# EAGLE design CANBed2040_V1.1 (EAGLE 6.4)
DESCRIPTION: microOBD 200 OBD-II Module; HW_REV: 1.4; PCB_REV: C; PCB_SPEC1: Layer Count: 4; PCB_SPEC2: Size: 1.3" x 0.59"; PCB_SPEC3: Finish Thickness: 0.049" - 0.052"; PCB_SPEC4: Copper Weight: 1oz; TITLE: STM1120

## Sheet 1 of 2
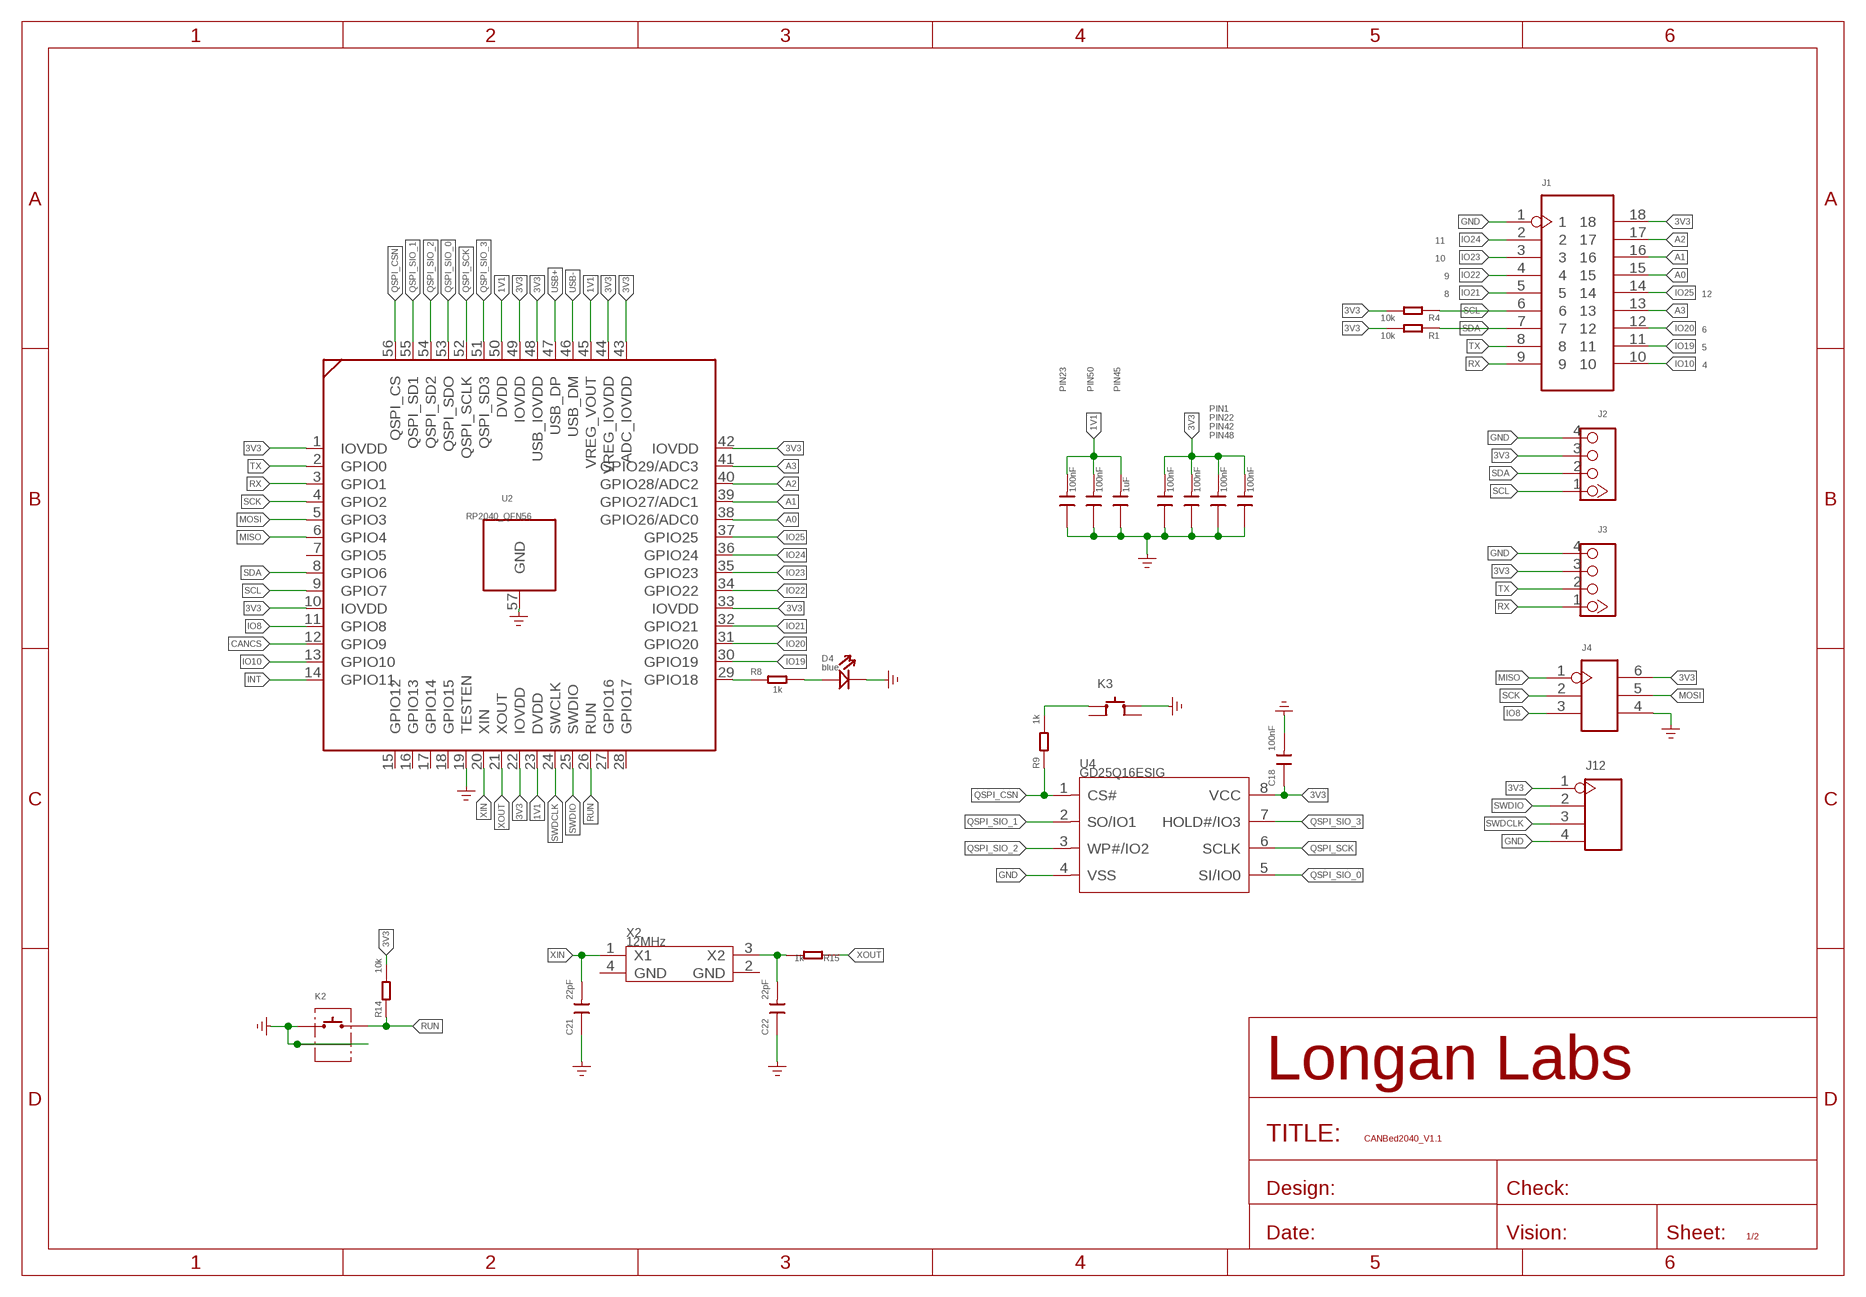
[diagram p0: schematic, sheet 1, part 1 of 2]
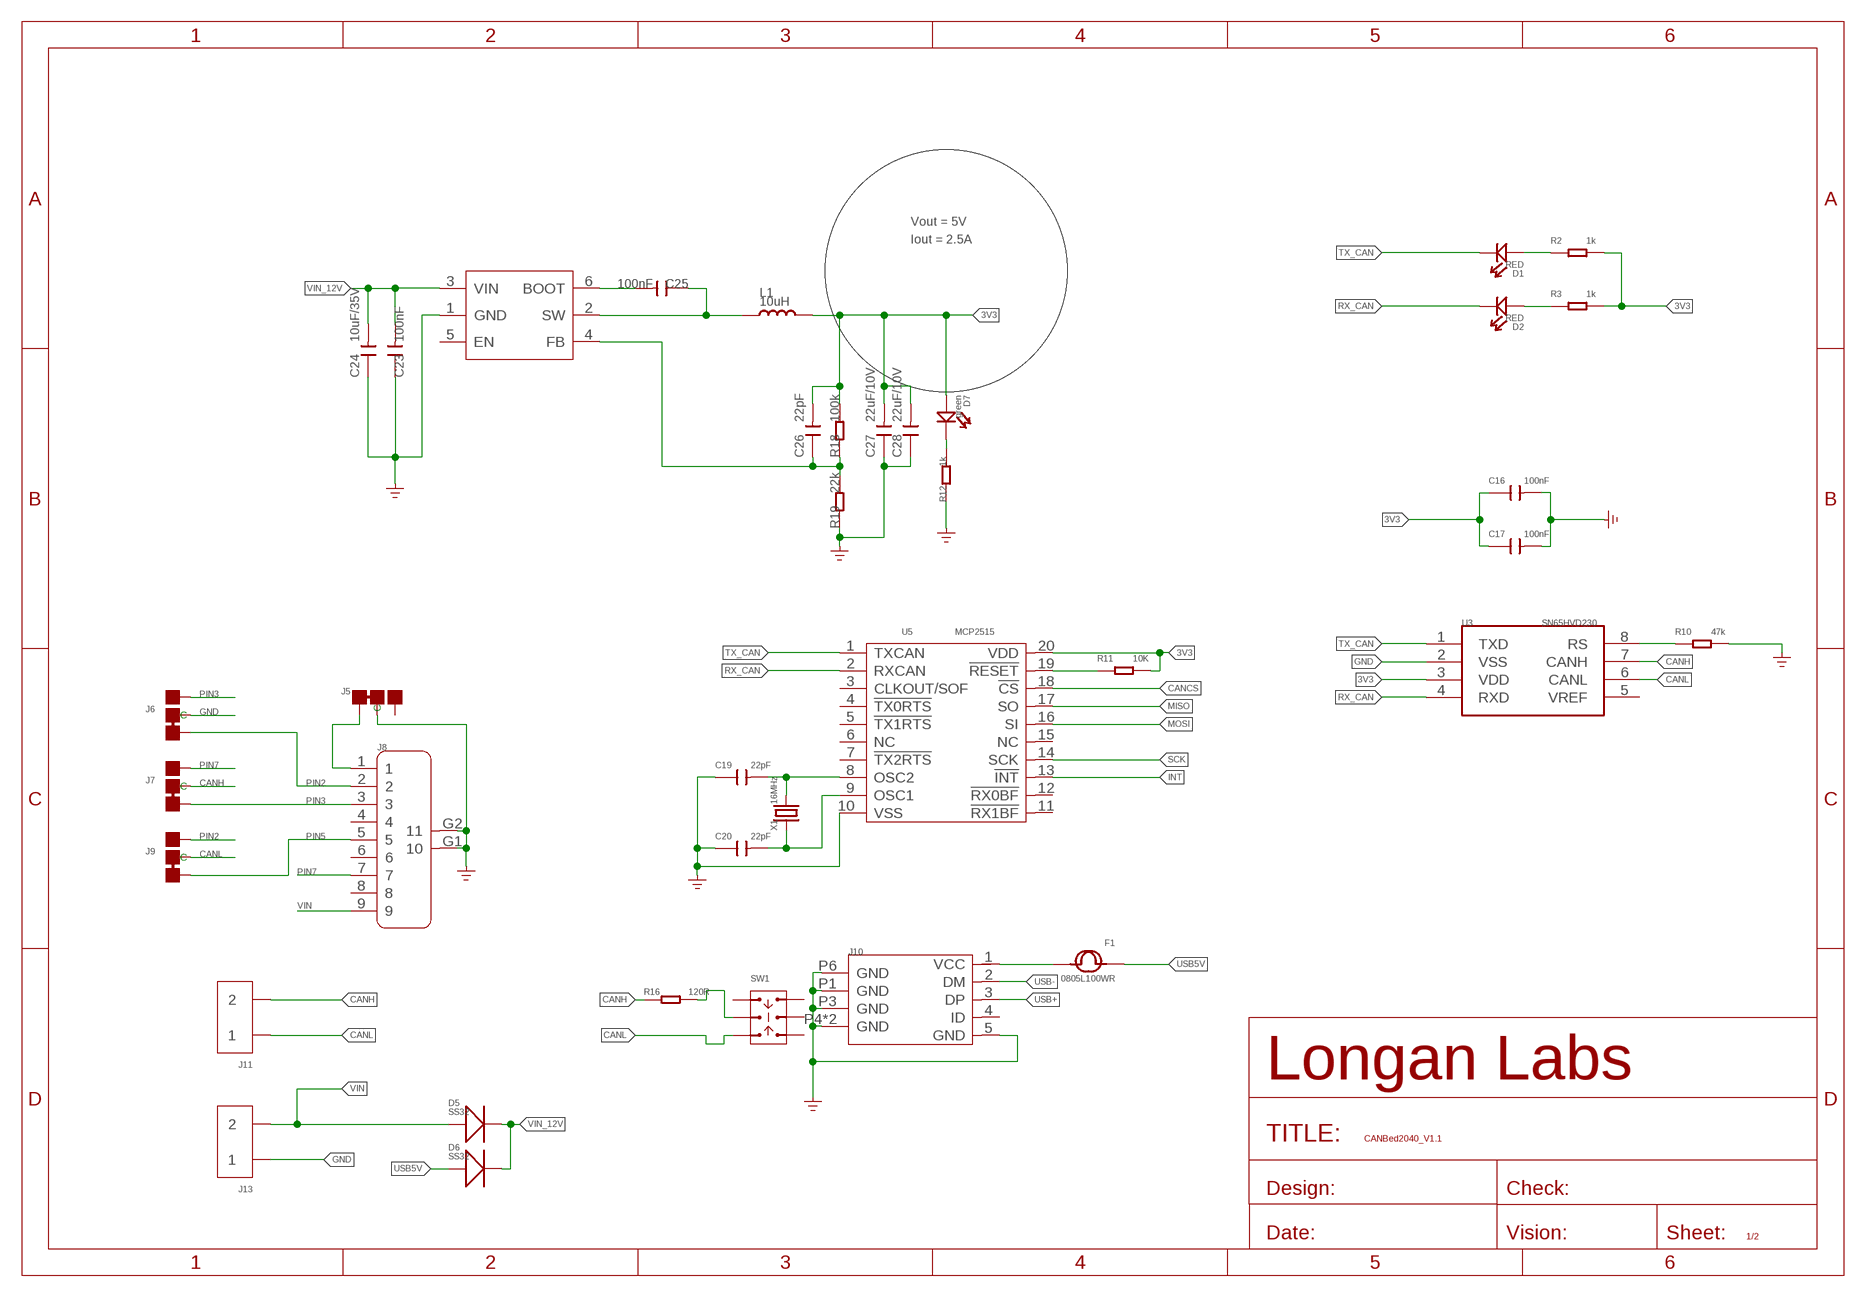
[diagram p1: schematic, sheet 1, part 2 of 2]

### Parts
C9  100nF  CAP-0603  [C0603]
C10  100nF  CAP-0603  [C0603]
C11  1uF  CAP-0603  [C0603]
C12  100nF  CAP-0603  [C0603]
C13  100nF  CAP-0603  [C0603]
C14  100nF  CAP-0603  [C0603]
C15  100nF  CAP-0603  [C0603]
C16  100nF  CAP-0603  [C0603]
C17  100nF  CAP-0603  [C0603]
C18  100nF  CAP-0603  [C0603]
C19  22pF  CAP-0603  [C0603]
C20  22pF  CAP-0603  [C0603]
C21  22pF  CAP-0603  [C0603]
C22  22pF  CAP-0603  [C0603]
C23  100nF  CAP-0603  [C0603]
C24  10uF/35V  CAP-1206  [C1206]
C25  100nF  CAP-0603  [C0603]
C26  22pF  CAP-0603  [C0603]
C27  22uF/10V  CAP-0805  [C0805]
C28  22uF/10V  CAP-0805  [C0805]
D1  RED  LED'0603'  [LED-0603]
D2  RED  LED'0603'  [LED-0603]
D4  blue  LED'0603'  [LED-0603]
D5  SS32  DIODE'SMA'  [DO-214AC]
D6  SS32  DIODE'SMA'  [DO-214AC]
D7  green  LED'0603'  [LED-0603]
F1  0805L100WR  FUSE0805  [F0805]
J1  HEADER-2X9P-2.54  [H2X9-2.54]
J2  320110033  GROVE-CONNECTOR-DIP-2.0  [HW4-2.0]
J3  320110033  GROVE-CONNECTOR-DIP-2.0  [HW4-2.0]
J4  HEADER-2X3P-2.54  [H2X3-2.54]
J5  JUMPER-3P-SHORT  [3P-SMD-SHORT]
J6  JUMPER-3P-SHORT  [3P-SMD-SHORT]
J7  JUMPER-3P-SHORT  [3P-SMD-SHORT]
J8  DB9'MEAL'  [DB9-MEAL]
J9  JUMPER-3P-SHORT  [3P-SMD-SHORT]
J10  MICRO-USB5+4P-320010050  [MICRO-USB5+5P-SMD-0.65-7.2X5.06MM]
J11  SCREW-TERMINAL-2P'5.08'  [H2-5.0-10.5X8.0MM]
J12  HEADER-4P-65/35MIL  [H4-2.54]
J13  SCREW-TERMINAL-2P'5.08'  [H2-5.0-10.5X8.0MM]
K2  BUTTON-2+2P  [SW2+2P-7.7X2.75X3.95MM]
K3  BUTTON-4P-4.5X4.5X3.3MM  [SW4-4.5X4.5X3.3MM]
L1  10uH  INDUCTOR-SPD3D16-4R7M  [L0420]
R1  10k  RES-0603  [R0603]
R2  1k  RES-0603  [R0603]
R3  1k  RES-0603  [R0603]
R4  10k  RES-0603  [R0603]
R8  1k  RES-0603  [R0603]
R9  1k  RES-0603  [R0603]
R10  47k  RES-0603  [R0603]
R11  10K  RES-0603  [R0603]
R12  1k  RES-0603  [R0603]
R14  10k  RES-0603  [R0603]
R15  1k  RES-0603  [R0603]
R16  120R  RES-0603  [R0603]
R18  100k  RES-0603  [R0603]
R19  22k  RES-0603  [R0603]
SW1  SWITCH-2CH-6P-311010004  [SW6-2.54-9.0X3.5X3.2+2.0MM]
U2  RP2040_QFN56  [RP2040_QFN56]
U3  SN65HVD230  MCP2551-SOIC8  [SOIC8-6.0]
U4  GD25Q16ESIG  FLASH-GD25Q16E  [SOP8-1.27-5.3X5.25X2MM]
U5  MCP2515  MCP2515'ST'  [TSSOP20-0.65-6.5X4.4MM]
U6  PMIC-TPS54302  [SOT-23-6]
X1  16MHz  CRYSTAL-2P-3225  [X4-SMD-3.2X2.5X0.7MM]
X2  12MHz  CRYSTAL-4P-3225  [X4-SMD-3.2X2.5X0.7MM]

### Nets
1V1: C9.2 C10.2 C11.2 U2.23(DVDD) U2.45(VREG_VOUT) U2.50(DVDD)
3V3: C12.2 C13.2 C14.2 C15.2 C16.1 C17.1 C18.1 C26.2 C27.2 C28.2 D7.+ J1.18 J2.3 J3.3 J4.6 J12.1 L1.2 R1.2 R2.2 R3.2 R4.2 R11.2 R14.2 R18.2 U2.1(IOVDD) U2.10(IOVDD) U2.22(IOVDD) U2.33(IOVDD) U2.42(IOVDD) U2.43(ADC_IOVDD) U2.44(VREG_IOVDD) U2.48(USB_IOVDD) U2.49(IOVDD) U3.3(VDD) U4.8(VCC) U5.20(VDD)
A0: J1.15 U2.38(GPIO26/ADC0)
A1: J1.16 U2.39(GPIO27/ADC1)
A2: J1.17 U2.40(GPIO28/ADC2)
A3: J1.13 U2.41(GPIO29/ADC3)
CANCS: U2.12(GPIO9) U5.18(!CS)
CANH: J7.MM(C) J11.2 R16.1 U3.7(CANH)
CANL: J9.MM(C) J11.1 SW1.CH1B U3.6(CANL)
EXT_PWR: F1.2 J10.1(VCC)
GND: C9.1 C10.1 C11.1 C12.1 C13.1 C14.1 C15.1 C16.2 C17.2 C18.2 C19.1 C20.1 C21.1 C22.1 C23.1 C24.1 C27.1 C28.1 D4.- J1.1 J2.4 J3.4 J4.4 J5.MM(C) J6.MM(C) J8.G1 J8.G2 J10.5(GND) J10.P1(GND) J10.P3(GND) J10.P4(GND) J10.P5(GND) J10.P6(GND) J12.4 J13.1 K2.1 K2.S1 K2.S2 K3.3(B0) R10.2 R12.1 R19.1 U2.19(TESTEN) U2.57(GND) U3.2(VSS) U4.4(VSS) U5.10(VSS) U6.1(GND) ; supply symbol labelled GND_POWER
INT: U2.14(GPIO11) U5.13(!INT)
IO8: J4.3 U2.11(GPIO8)
IO10: J1.10 U2.13(GPIO10)
IO19: J1.11 U2.30(GPIO19)
IO20: J1.12 U2.31(GPIO20)
IO21: J1.5 U2.32(GPIO21)
IO22: J1.4 U2.34(GPIO22)
IO23: J1.3 U2.35(GPIO23)
IO24: J1.2 U2.36(GPIO24)
IO25: J1.14 U2.37(GPIO25)
MISO: J4.1 U2.6(GPIO4) U5.17(SO)
MOSI: J4.5 U2.5(GPIO3) U5.16(SI)
N$2: D1.+ R2.1
N$3: R8.1 U2.29(GPIO18)
N$5: R16.2 SW1.COM1
N$6: D4.+ R8.2
N$7: K3.1(A0) R9.2
N$8: C22.2 R15.2 X2.3(X2)
N$11: D7.- R12.2
N$12: C25.1 L1.1 U6.2(SW)
N$13: J5.11(L) J8.1
N$14: C25.2 U6.6(BOOT)
N$15: D2.+ R3.1
N$16: C19.2 U5.8(OSC2) X1.3
N$17: C20.2 U5.9(OSC1) X1.1
N$20: R10.1 U3.8(RS)
N$26: C26.1 R18.1 R19.2 U6.4(FB)
PIN2: J6.11(L) J8.2 J9.00(R)
PIN3: J6.00(R) J7.11(L) J8.3
PIN5: J8.5 J9.11(L)
PIN7: J7.00(R) J8.7
QSPI_CSN: R9.1 U2.56(QSPI_CS) U4.1(CS#)
QSPI_SCK: U2.52(QSPI_SCLK) U4.6(SCLK)
QSPI_SIO_0: U2.53(QSPI_SDO) U4.5(SI/IO0)
QSPI_SIO_1: U2.55(QSPI_SD1) U4.2(SO/IO1)
QSPI_SIO_2: U2.54(QSPI_SD2) U4.3(WP#/IO2)
QSPI_SIO_3: U2.51(QSPI_SD3) U4.7(HOLD#/IO3)
RST_N: R11.1 U5.19(!RESET)
RUN: K2.2 R14.1 U2.26(RUN)
RX: J1.9 J3.1 U2.3(GPIO1)
RX_CAN: D2.- U3.4(RXD) U5.2(RXCAN)
SCK: J4.2 U2.4(GPIO2) U5.14(SCK)
SCL: J1.6 J2.1 R4.1 U2.9(GPIO7)
SDA: J1.7 J2.2 R1.1 U2.8(GPIO6)
SWDCLK: J12.3 U2.24(SWCLK)
SWDIO: J12.2 U2.25(SWDIO)
TX: J1.8 J3.2 U2.2(GPIO0)
TX_CAN: D1.- U3.1(TXD) U5.1(TXCAN)
USB5V: D6.1(+) F1.1
USB+: J10.3(DP) U2.47(USB_DP)
USB-: J10.2(DM) U2.46(USB_DM)
VIN: D5.1(+) J8.9 J13.2
VIN_12V: C23.2 C24.2 D5.2(-) D6.2(-) U6.3(VIN)
XIN: C21.2 U2.20(XIN) X2.1(X1)
XOUT: R15.1 U2.21(XOUT)
Unconnected: J5.00(R) J8.4 J8.6 J8.8 J10.4(ID) K3.2(A1) K3.4(B1) SW1.CH1A SW1.CH2A SW1.CH2B SW1.COM2 U2.7(GPIO5) U2.15(GPIO12) U2.16(GPIO13) U2.17(GPIO14) U2.18(GPIO15) U2.27(GPIO16) U2.28(GPIO17) U3.5(VREF) U5.3(CLKOUT/SOF) U5.4(!TX0RTS) U5.5(!TX1RTS) U5.6(NC) U5.7(!TX2RTS) U5.11(!RX1BF) U5.12(!RX0BF) U5.15(NC) U6.5(EN) X2.2(GND) X2.4(GND)

### Notes on the sheet
- Vout = 5V
- 11 | Iout = 2.5A
- 10
- 9
- 8 | 12
- 6
- 5
- 4
- PIN23 | PIN50 | PIN45
- PIN1
- PIN22
- PIN42
- PIN48

## Sheet 2 of 2

## Library data of the parts
C9-C28 = Discrete-new:CAP: Ceramic Capacitors
D1 D2 D4 D7 = Discrete-new:LED
D5 D6 = Discrete-new:DIODE*
F1 = Discrete-small:FUSE
J1 = Connector-new:HEADER-2X9P
J2 J3 = Connector-new:GROVE-CONNECTOR-DIP: 4P-2.0:320110033;4P-2.0-90D:320110034
J4 = Connector-new:HEADER-2X3P
J5-J7 J9 = Discrete-new:JUMPER-3P-SHORT
J8 = Connector:DB9
J10 = Connector-new:MICRO-USB5+4P: 320010137:MICRO USB B型DIP 沉板0.7无卷边 -ST-USB-01H2 320010000:MICRO USB 5F CCHT 6.45(0.8X0.9) -ST-USB-001G 320010050:USB-MC-001-05 320010025:MICRO USB 5S AB TYPE DIP7.2
J11 J13 = Connector-new:SCREW-TERMINAL-2P: 2P-3.5:320110028;2P-5.0:320110031
J12 = Connector-new:HEADER-4P
K2 = Connector-new:BUTTON-2+2P
K3 = Switch:BUTTON-4P
L1 = Discrete-new:INDUCTOR
R1-R4 R8-R12 R14-R16 R18 R19 = Discrete-new:RES
SW1 = Switch:SWITCH-2CH-6P
U2 = RP2040_QFN56:RP2040_QFN56
U3 = IC:MCP2551: High-Speed CAN Transceiver http://ww1.microchip.com/downloads/en/devicedoc/21667f.pdf
U4 = Longan-IC:FLASH-GD25Q16E
U5 = Heilight:MCP2515
U6 = IC-new:PMIC-TPS54302
X1 = Discrete-new:CRYSTAL-2P
X2 = Discrete-new:CRYSTAL-4P

## Net classes
3 usbvcc: width 0.152 mm, drill 0.152 mm, clearance 0.152 mm

## Board
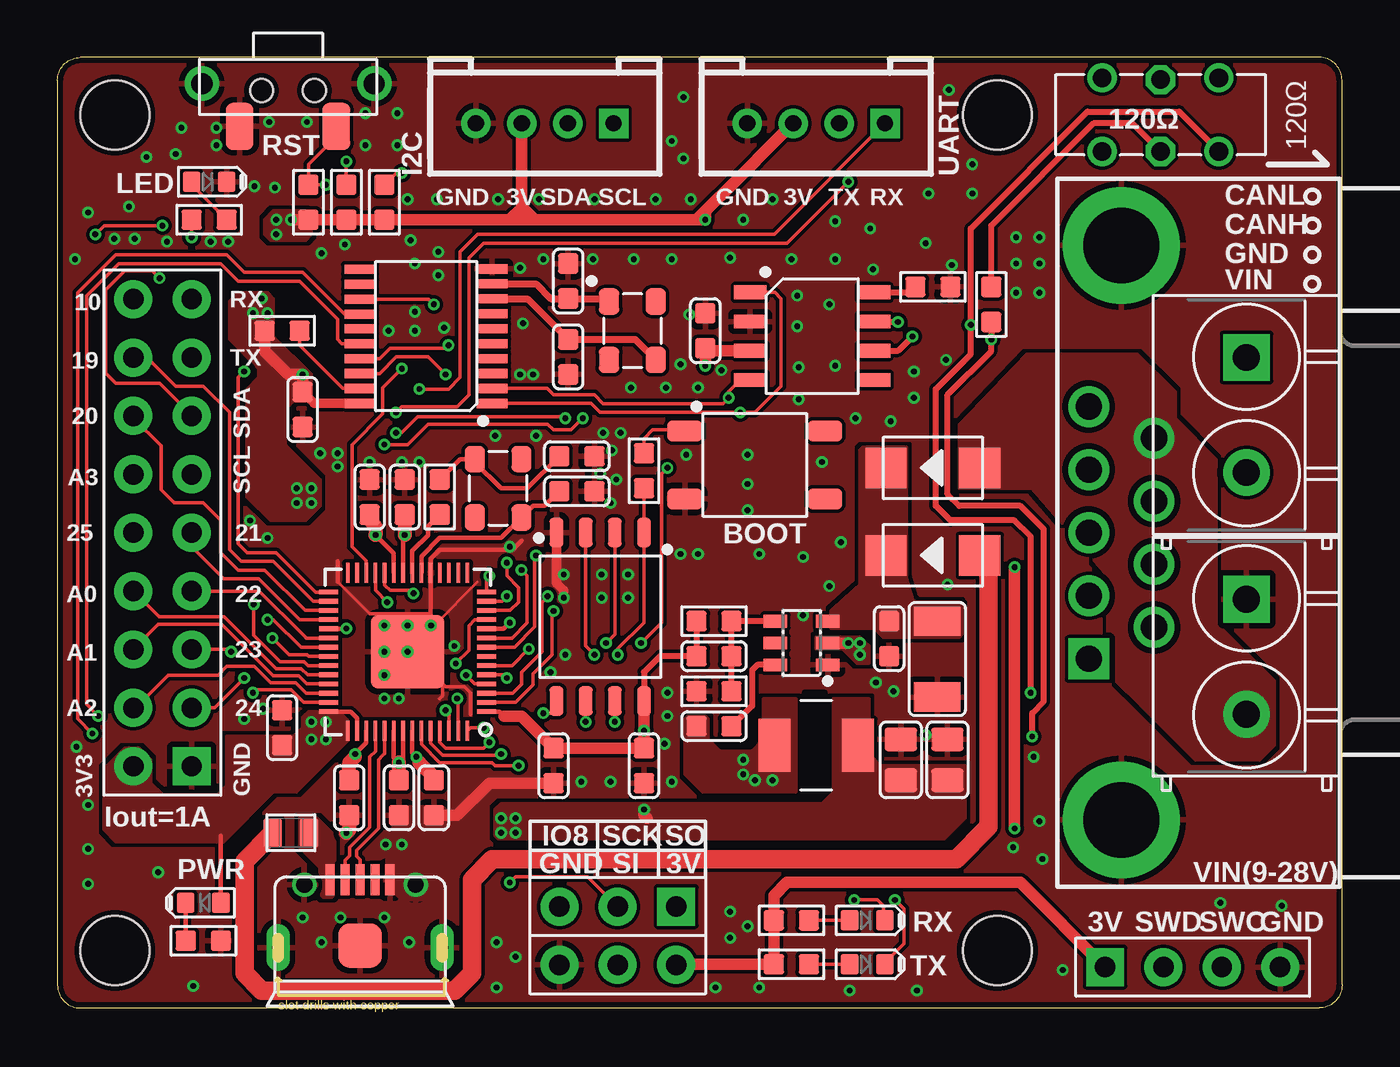
[diagram p2: board, top side]
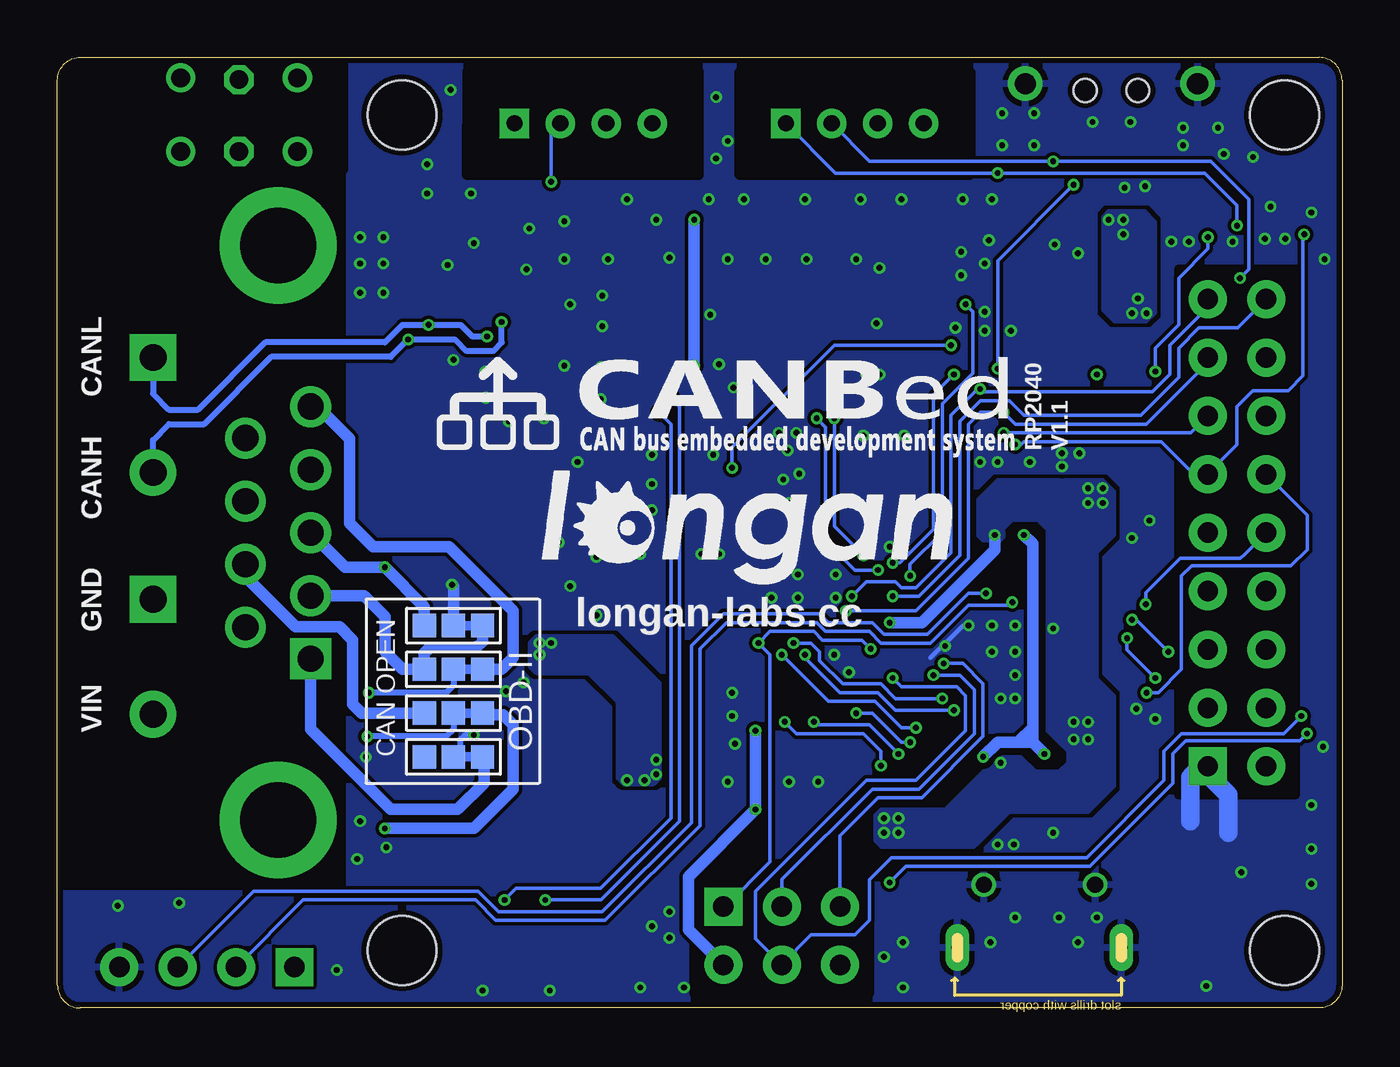
[diagram p3: board, bottom side, seen from below]

Size 55.91 x 41.35 mm. Coordinates in mm from the lower left corner, seen from the top.
Outline: 1,0 54.91,0 arc90 55.91,1 55.91,40.35 arc84 55.01,41.35 1,41.35 arc90 0,40.35 0,1 arc90 1,0
Copper layers (1*16): Top 0.035mm / dielectric 1.5mm / Bottom 0.035mm
Design rules "SeeedStudio_2layer_DRU_no_angle_20140221": minimum track width 1mil, minimum drill 10mil, track to track 6mil, track to pad 6mil, pad to pad 6mil, via to via 6mil, smd to smd 0mil, copper to edge 10mil, drill to drill 10mil, minimum pad ring 4mil, minimum via ring 4mil, stop-mask expansion 2mil, vias tented up to drill 25mil, thermal gap 10mil
Holes 3 mm at 2.5,38.85 2.5,2.5 40.91,38.85 40.91,2.5
tRestrict: area 32.5,9.5 to 33.4,13.7
bRestrict: area 16.2,36.3 to 26.2,40.7; area 28,36.2 to 38.1,40.7; area 2,9.3 to 7.1,32.1; area 43.6,5.3 to 55.8,36.1; area 20.6,0.6 to 28.2,5.7; area 43.4,36.5 to 52.6,41.3

### Footprints (pad centres in the part's own frame; a part is rotated, then mirrored left to right if it is on the bottom)
C0603 = smd 0.889 x 0.889: 1 -0.762,0; 2 0.762,0
C1206 = smd 1.27 x 2.032: 1 -1.651,0; 2 1.651,0
C0805 = smd 1.016 x 1.397: 1 -0.889,0; 2 0.889,0
LED-0603 = smd 0.762 x 0.889: + 0.762,0; - -0.762,0
DO-214AC = smd 1.8 x 1.77: 1 -2.042,0; 2 2.042,0
F0805 = smd 0.819 x 1.27: 1 -0.79,0; 2 0.79,0
H2X9-2.54 = drill 0.889 pad 1.651 square: 1 -1.27,10.16 | drill 0.889 pad 1.651: 2 -1.27,7.62; 3 -1.27,5.08; 4 -1.27,2.54; 5 -1.27,0; 6 -1.27,-2.54; 7 -1.27,-5.08; 8 -1.27,-7.62; 9 -1.27,-10.16; 10 1.27,-10.16; 11 1.27,-7.62; 12 1.27,-5.08; 13 1.27,-2.54; 14 1.27,0; 15 1.27,2.54; 16 1.27,5.08; 17 1.27,7.62; 18 1.27,10.16
HW4-2.0 = drill 0.7 pad 1.27 square: 1 -3,0 | drill 0.7 pad 1.27: 2 -1,0; 3 1,0; 4 3,0
H2X3-2.54 = drill 0.889 pad 1.651 square: 1 -1.27,2.54 | drill 0.889 pad 1.651: 2 -1.27,0; 3 -1.27,-2.54; 4 1.27,-2.54; 5 1.27,0; 6 1.27,2.54
3P-SMD-SHORT = smd 1.016 x 1.016: 00 -1.27,0; 11 1.27,0; MM 0,0
DB9-MEAL = drill 1.143 pad 1.778 square: 1 -5.486,1.422 | drill 1.143 pad 1.778: 2 -2.743,1.422; 3 0,1.422; 4 2.743,1.422; 5 5.486,1.422; 6 -4.115,-1.422; 7 -1.372,-1.422; 8 1.372,-1.422; 9 4.115,-1.422 | drill 3.302 pad 5.08: G1 12.497,0; G2 -12.497,0
MICRO-USB5+5P-SMD-0.65-7.2X5.06MM = smd 0.4 x 1.35: 1 -1.3,2.875; 2 -0.65,2.875; 3 0,2.875; 4 0.65,2.875; 5 1.3,2.875 | smd 1.9 x 1.9: P1 0,0 | drill 0.508 pad 1.016 long: P3 -3.575,-0.08; P4 3.575,-0.08 | drill 0.7: P5 -2.425,2.65; P6 2.425,2.65
H2-5.0-10.5X8.0MM = drill 1.168 pad 2.032 square: 1 0,2.5 | drill 1.168 pad 2.032: 2 0,-2.5
H4-2.54 = drill 0.889 pad 1.651 square: 1 0,3.81 | drill 0.889 pad 1.651: 2 0,1.27; 3 0,-1.27; 4 0,-3.81
SW2+2P-7.7X2.75X3.95MM = smd 1.2 x 2.032: 1 -2.1,-0.254; 2 2.1,-0.254 | drill 0.924 pad 1.5: S1 -3.75,1.6; S2 3.75,1.6 | hole 1: -1.15,1.3; 1.15,1.3
SW4-4.5X4.5X3.3MM = smd 1.5 x 0.9: 1 -3.05,1.475; 2 3.05,1.475; 3 -3.05,-1.475; 4 3.05,-1.475
L0420 = smd 1.4 x 2.3: 1 -1.815,0; 2 1.815,0
R0603 = smd 0.889 x 0.889: 1 -0.762,0; 2 0.762,0
SW6-2.54-9.0X3.5X3.2+2.0MM = drill 0.813 pad 1.27: CH1A -2.54,-1.6; CH1B 2.54,-1.6; CH2A -2.54,1.6; CH2B 2.54,1.6 | drill 0.813 pad 1.27 octagon: COM1 0,-1.6; COM2 0,1.524
RP2040_QFN56 = smd 0.875 x 0.2: 1 -3.438,2.6; 2 -3.438,2.2; 3 -3.438,1.8; 4 -3.438,1.4; 5 -3.438,1; 6 -3.438,0.6; 7 -3.438,0.2; 8 -3.438,-0.2; 9 -3.438,-0.6; 10 -3.438,-1; 11 -3.438,-1.4; 12 -3.438,-1.8; 13 -3.438,-2.2; 14 -3.438,-2.6; 29 3.438,-2.6; 30 3.438,-2.2; 31 3.438,-1.8; 32 3.438,-1.4; 33 3.438,-1; 34 3.438,-0.6; 35 3.438,-0.2; 36 3.438,0.2; 37 3.438,0.6; 38 3.438,1; 39 3.438,1.4; 40 3.438,1.8; 41 3.438,2.2; 42 3.438,2.6 | smd 0.2 x 0.875: 15 -2.6,-3.438; 16 -2.2,-3.438; 17 -1.8,-3.438; 18 -1.4,-3.438; 19 -1,-3.438; 20 -0.6,-3.438; 21 -0.2,-3.438; 22 0.2,-3.438; 23 0.6,-3.438; 24 1,-3.438; 25 1.4,-3.438; 26 1.8,-3.438; 27 2.2,-3.438; 28 2.6,-3.438; 43 2.6,3.438; 44 2.2,3.438; 45 1.8,3.438; 46 1.4,3.438; 47 1,3.438; 48 0.6,3.438; 49 0.2,3.438; 50 -0.2,3.438; 51 -0.6,3.438; 52 -1,3.438; 53 -1.4,3.438; 54 -1.8,3.438; 55 -2.2,3.438; 56 -2.6,3.438 | smd 3.2 x 3.2: 57 0,0
SOIC8-6.0 = smd 0.6 x 1.4: 1 -1.905,-2.7; 2 -0.635,-2.7; 3 0.635,-2.7; 4 1.905,-2.7; 5 1.905,2.7; 6 0.635,2.7; 7 -0.635,2.7; 8 -1.905,2.7
SOP8-1.27-5.3X5.25X2MM = smd 0.6 x 1.27: 1 -1.905,-3.665; 2 -0.635,-3.665; 3 0.635,-3.665; 4 1.905,-3.665; 5 1.905,3.665; 6 0.635,3.665; 7 -0.635,3.665; 8 -1.905,3.665
TSSOP20-0.65-6.5X4.4MM = smd 0.4 x 1.35: 1 -2.925,-2.875; 2 -2.275,-2.875; 3 -1.625,-2.875; 4 -0.975,-2.875; 5 -0.325,-2.875; 6 0.325,-2.875; 7 0.975,-2.875; 8 1.625,-2.875; 9 2.275,-2.875; 10 2.925,-2.875; 11 2.91,2.875; 12 2.26,2.875; 13 1.61,2.875; 14 0.96,2.875; 15 0.325,2.875; 16 -0.325,2.875; 17 -0.975,2.875; 18 -1.625,2.875; 19 -2.275,2.875; 20 -2.925,2.875
SOT-23-6 = smd 0.55 x 1.016: 1 -0.95,-1.143; 2 0,-1.143; 3 0.95,-1.143; 4 0.95,1.143; 5 0,1.143; 6 -0.95,1.143
X4-SMD-3.2X2.5X0.7MM = smd 1.143 x 0.889: 1 -1.27,-1.016; 2 1.27,-1.016; 3 1.27,1.016; 4 -1.27,1.016

### Placement (x,y rotation side)
C9  13.59,22.23 270 top
C10  16.38,9.14 90 top
C11  12.7,9.14 90 top
C12  21.59,10.54 90 top
C13  15.11,22.23 270 top
C14  9.78,12.19 270 top
C15  14.86,9.14 90 top
C16  10.67,26.04 270 top
C17  28.19,29.46 90 top
C18  25.53,10.54 270 top
C19  22.22,28.32 90 top
C20  22.22,31.62 270 top
C21  22.61,22.48 180 top
C22  22.61,24 180 top
C23  36.19,16.07 90 top
C24  38.29,15.18 90 top
C25  28.57,12.26 0 top
C26  28.57,15.3 180 top
C27  36.7,10.8 270 top
C28  38.73,10.8 270 top
D1  35.24,1.91 180 top
D2  35.24,3.81 180 top
D4  6.6,35.94 180 top
D5  38.1,23.5 180 top
D6  38.1,19.68 180 top
D7  6.35,4.57 0 top
F1  10.16,7.62 0 top
J1  4.57,20.68 180 top
J2  21.21,38.48 180 top
J3  33.02,38.48 180 top
J4  24.38,3.14 270 top
J5  38.67,10.92 0 bottom
J6  38.67,16.64 0 bottom
J7  38.67,12.83 0 bottom
J8  46.31,20.68 90 top
J9  38.67,14.73 0 bottom
J10  13.17,2.71 0 top
J11  51.75,25.8 0 top
J12  49.4,1.78 90 top
J13  51.75,15.28 0 top
K2  10.03,38.61 0 top
K3  30.35,23.62 0 top
L1  33.02,11.43 0 top
R1  12.57,35.05 270 top
R2  31.94,1.91 180 top
R3  31.94,3.81 180 top
R4  14.22,35.05 270 top
R8  6.6,34.29 0 top
R9  25.53,23.37 90 top
R10  38.1,31.37 0 top
R11  9.78,29.46 180 top
R12  6.35,2.92 180 top
R14  10.92,35.05 270 top
R15  16.64,22.23 90 top
R16  40.64,30.61 90 top
R18  28.57,16.83 180 top
R19  28.57,13.78 0 top
SW1  48.01,38.86 0 top
U2  15.24,15.49 180 top
U3  32.85,29.23 270 top
U4  23.62,17.02 180 top
U5  16.05,29.22 90 top
U6  32.38,15.88 90 top
U$12  [LONGAN-SILK-SMALL]  36.44,16.97 0 bottom
X1  25.02,29.46 270 top
X2  19.18,22.61 90 top

### Tracks (layer width: path | path; a pad name or v marks a point on that pad's centre or on a via)
1V1  (via drill 0.25 pad 0.51)
  Top 0.203: U2.23 14.64,19.78 v13.84,20.57 | U2.45 13.44,11.53 v12.95,11.05 12.95,10.92 | U2.50 15.44,11.1 v15.62,10.92 15.62,10.8 15.75,10.67
  Top 0.61: C9.2 13.59,21.21 13.84,20.95 v13.84,20.57 | C10.2 16.38,10.03 15.75,10.67 | C11.2 12.7,10.67 12.95,10.92
  Bottom 0.508: v12.95,11.05 13.46,11.56 | 13.46,11.56 14.1,11.56 | 14.1,11.56 14.99,11.56 v15.62,10.92 | 13.46,11.56 13.46,12.19 | v13.84,20.57 13.46,20.19 13.46,12.57 13.46,12.19 | 13.46,12.19 14.1,11.56
3V3  (via drill 0.25 pad 0.51)
  Top 0.203: U2.33 12.56,16.49 v12.57,16.51 | U2.22 15.04,20.5 v15.11,20.57 | U2.44 13.04,12.61 12.76,12.89 U2.42 | U2.48 14.64,10.89 v14.86,10.67 15.04,10.85 U2.49 | U2.1 19.24,12.89 19.43,12.7 | U2.10 19.41,16.49 v19.68,16.76 | D7.+ 7.11,7.49
  Top 0.254: R18.2 C26.2 26.23,15.3 25.53,14.6 U4.8
  Top 0.406: C16.1 11.16,26.3 U5.20 | C12.2 21.84,11.3
  Top 0.508: J2.3 20.21,34.31 20.19,34.29 | J4.6 26.96,1.91 R2.2 R3.2 31.18,4.89 31.75,5.46 41.91,5.46 J12.1 | J3.3 28.84,35.31 28.83,35.31 28.19,34.67 | C16.1 v10.67,27.56 10.03,27.56 9.02,28.57 R11.2 | v10.16,34.29 R14.2 R1.2 R4.2 19.68,34.29 | 19.43,12.7 20.19,12.7 C12.2 C18.1 v25.53,12.06 U4.8 | U3.3 28.3,28.59 C17.1 v28.19,27.94 | 19.68,34.29 20.19,34.29 | 20.19,34.29 20.76,34.29 | 20.76,34.29 27.81,34.29 | 27.81,34.29 v28.19,34.29 28.19,34.67 | 19.68,34.29 20.19,34.8 20.26,34.8 20.76,34.29 | 27.81,34.29 28.19,34.67 | v25.53,8.64 25.53,8.38 25.65,8.26
  Top 0.61: C13.2 v15.11,20.57 | C15.2 v14.86,10.67
  Bottom 0.508: J4.6 28.45,3.4 28.45,5.72 v25.53,8.64 v25.53,12.06 | v15.11,20.57 15.11,19.94 18.29,16.76 v19.68,16.76 | v28.19,27.94 v28.19,34.29
  other vias: 11.05,12.45 11.05,11.68 11.68,11.68 11.68,12.45 19.3,8.26 19.94,8.26 19.94,7.62 19.3,7.62 11.05,22.61 10.41,22.61 10.41,21.97 11.05,21.97 9.14,30.23 8.51,30.23 8.89,30.86 9.52,34.29 9.52,33.66
  pour Top (isolate 0.254, no thermals): 9.4,9.4 7.24,7.24 2.54,7.24 2.03,7.75 2.03,10.41 2.92,11.3 3.56,11.3 4.06,10.8 4.06,9.78 4.57,9.27 6.96,9.27 7.37,9.67 7.37,11.81 10.29,11.81 10.67,12.19 10.67,12.64 10.92,12.89 12.26,12.89 12.64,12.51 12.64,11.62 10.41,9.4 10.14,9.4
  pour Bottom (isolate 0.254, no thermals): 14.35,21.21 13.23,21.21 12.83,20.81 12.83,12.06 11.94,11.18 11.94,10.67 12.32,10.29 13.33,10.29 13.97,10.92 14.99,10.92 17.27,8.64 20.07,8.64 20.32,8.38 20.32,7.27 20.04,6.98 16.03,6.98 15.87,7.11 14.48,8.51 11.05,8.51 9.91,9.65 9.91,13.59 10.67,14.35 10.67,19.81 9.91,20.57 9.91,22.48 10.41,22.99 14.99,22.99 15.87,22.1 15.87,20.57 15.62,20.32 14.86,20.32 14.73,20.45 14.73,20.83
  pour Top (isolate 0.254, no thermals): 11.43,21.84 11.43,22.99 9.91,24.51 9.91,26.04 10.29,26.42 10.79,26.42 11.05,26.67 11.05,27.56 9.4,29.21 9.4,30.86 9.14,31.11 7.87,31.11 7.49,30.73 7.49,29.08 8.76,27.81 8.76,27.43 8.25,26.92 8.25,22.23 9.27,21.21 10.79,21.21
  pour Bottom (isolate 0.254, no thermals): 10.16,34.67 8.59,34.67 8.13,34.21 8.13,30.23 8.51,29.84 9.91,29.84 10.41,30.35 10.41,34.42
  pour Top (isolate 0.254, no thermals): 10.67,34.67 9.4,34.67 9.02,34.29 9.02,33.66 9.27,33.4 10.79,33.4 11.05,33.66 11.05,34.42 10.79,34.67
  pour Top (isolate 0.254, no thermals): 39.5,9.27 33.78,9.27 33.78,13.46 35.31,13.46 35.31,11.05 35.81,10.54 39.5,10.54
  pour Top (isolate 0.254, no thermals): 19.18,7.37 38.61,7.37 39.5,8.26 39.5,9.27 39.24,9.52 33.91,9.52 33.27,8.89 19.3,8.89 19.05,8.64 19.05,7.49
A0
  Top 0.152: J1.15 4.42,17.02 7.26,17.02 9.52,14.76 10.62,14.76 10.88,14.49 U2.38
A1
  Top 0.152: J1.16 3.3,15.62 4.38,16.7 7.15,16.7 9.4,14.45 10.49,14.45 10.85,14.09 U2.39
A2
  Top 0.152: J1.17 3.4,13.05 4.83,14.48 6.98,14.48 7.37,14.86 8.56,14.86 9.27,14.15 10.36,14.15 10.82,13.69 U2.40
A3  (via drill 0.25 pad 0.51)
  Top 0.152: U2.41 10.71,13.29 10.16,13.84 8.64,13.84 v8.51,13.72
  Bottom 0.152: J1.13 1.52,21.44 1.52,19.94 2.22,19.24 6.54,19.24 6.98,18.8 6.98,14.73 8,13.72 v8.51,13.72
CANCS  (via drill 0.25 pad 0.51)
  Top 0.152: U2.12 19.71,17.29 20.07,17.65 20.07,18.29 19.56,18.8 v19.56,19.37 | U5.18 14.01,27.6 14.73,28.32 16.13,28.32 v16.89,27.56
  Bottom 0.152: v16.89,27.56 17.78,26.67 17.78,20.83 19.24,19.37 v19.56,19.37
CANH  (via drill 0.25 pad 0.51)
  Top 0.254: v42.42,11.81 42.42,12.83 42.93,13.34 42.93,20.83 41.91,21.84 39.24,21.84 38.73,22.35 38.73,26.67 40.64,28.57 v40.64,29.08 R16.1 | U3.7 36.56,29.86 v36.58,29.84
  Bottom 0.254: J7.MM 38.67,12.13 38.99,11.81 v42.42,11.81 | v36.58,29.84 36.58,28.96 36.96,28.57 38.1,28.57 38.61,29.08 v40.64,29.08 41.4,28.32 46.59,28.32 49.52,25.4 51.05,25.4 51.75,24.71 J11.2
CANL  (via drill 0.25 pad 0.51)
  Top 0.254: v42.35,13.72 42.35,20.51 41.66,21.21 38.86,21.21 38.23,21.84 38.23,26.92 39.75,28.45 v39.75,29.72 39.75,33.91 44.83,38.99 48.82,38.99 SW1.CH1B | U3.6 36.59,28.59 v37.21,29.21
  Bottom 0.254: J9.MM 38.67,14.03 38.99,13.72 v42.35,13.72 | v37.21,29.21 37.85,29.21 38.35,29.72 v39.75,29.72 40.89,29.72 41.66,28.96 46.86,28.96 49.78,26.04 51.05,26.04 51.75,26.73 J11.1
EXT_PWR
  pour Top (isolate 0.254, no thermals): 11.56,4.83 11.94,4.83 12.06,4.95 12.06,7.49 11.3,8.26 10.54,8.26 10.54,6.98 11.43,6.1 11.43,4.95
GND  (via drill 0.25 pad 0.51)
  Top 0.127: 13.58,17.15 12.19,18.54 | 18.28,18.54 16.38,16.64 v16.26,16.64
  Top 0.152: 16.24,17.15 13.58,17.15 | 15.24,15.37 15.49,15.37 16.76,14.1 | 16.76,14.1 16.89,13.97 17.72,13.97 17.97,13.72 17.97,12.76 | 16.76,14.1 16.76,13.59 16.64,13.46
  Top 0.203: U2.57 15.24,15.37 16.24,16.37 16.24,17.15 U2.19 16.24,19.54 16.64,19.94 19.81,19.94 20.19,20.32 | 12.19,18.54 12.19,19.43 | 21.72,20.32 21.78,20.26
  Top 0.406: 21.78,20.26 21.72,20.19 U4.4 21.72,18.48 22.03,18.16 v22.03,17.84
  Top 0.508: C12.1 18.8,9.78 17.4,8.38 C10.1
  Top 0.61: C11.1 12.7,7.75 v12.57,7.62
  Bottom 0.152: v16.26,16.64 16.51,16.64 | 38.29,11.75 37.91,11.75 v37.78,11.87
  Bottom 0.203: 16.51,16.64 17.91,15.24
  Bottom 0.254: 38.67,10.99 J5.MM 38.54,10.92 38.35,11.11 38.35,11.68 38.29,11.75 | v37.78,11.87 38.16,11.87 38.23,11.81
  Bottom 0.508: J5.MM 38.67,10.86 38.61,10.8 | J6.MM 38.67,18.35 v38.73,18.41
  Bottom 0.813: 4.95,7.62 4.95,9.27 5.84,10.16 J1.1 6.12,10.52 6.6,10.03 6.6,8.13
  other vias: 20.13,32.19 20.26,29.78 26.73,32.58 38.93,32.32 38.8,39.94 14.8,38.93 5.4,38.29 5.14,37.15 3.87,37.02 1.33,34.61 1.33,6.92 1.33,5.4 4.38,5.91 11.49,2.86 15.3,2.86 19.11,2.86 19.11,0.89 30.54,0.89 34.48,0.76 39.81,35.43 35.37,33.91 33.85,32.58 32.19,30.99 29.27,32.64 27.24,36.96 26.73,37.72 15.56,32.38 37.91,35.43 27.24,39.62 27.11,28 26.48,26.99 25.08,32.58 21.15,32.58 24.96,26.99 5.91,0.95 26.42,11.49 34.73,25.65 36.26,25.53 37.27,26.54 37.27,27.69 33.85,27.94 33.59,30.61 35.5,32.13 37.78,33.27 41.72,33.53 41.59,6.98 42.74,8.13 28.64,0.89 29.27,3.05 29.27,4.19 41.72,32.38 41.72,31.11 42.74,31.11 42.74,32.38 42.74,33.53 39.81,36.7 30.04,3.56 42.48,10.92 16.57,31.88 19.94,2.22 38.67,28.19 8.95,13.02 37.4,0.76 50.61,4.57 53.28,4.45 42.86,6.48 43.75,1.65 32.45,19.62 27.11,19.75 27.88,19.75 27.37,24.07 30.04,21.65 30.04,22.8 20.13,27.56 20.7,27.56 27.5,30.16 32.19,29.65 23.3,32.58 31.94,32.58 32.26,27.88 33.27,23.75 26.54,13.72 26.54,12.7 8.13,12.57 12.19,24.13 12.19,23.56 13.59,23.75 14.99,23.75 8.57,35.75 12.51,33.21 11.49,32.83 15.24,15.49 15.24,16.64 14.22,16.64 14.22,15.49 14.22,14.48 14.22,13.46 14.86,13.46 14.99,7.11 14.22,3.94 12.32,3.94 22.1,15.37 29.84,34.29 15.37,33.4 15.24,35.18 26.03,35.18 27.56,35.18 9.46,35.69 15.56,30.29 15.56,29.46 14.41,29.46 16.83,29.59 16.57,32.89 27.88,26.99 23.37,35.18 20.95,35.18 16.51,35.18 19.18,35.18 31.11,35.18 1.33,8.83 14.29,7.11 10.67,3.94 32.26,26.48 30.04,24.07 33.85,34.23 28.89,27.75 17.27,15.75 23.69,17.84 24.83,17.84 19.68,20.07 14.8,37.53 13.4,37.53 13.4,38.93 6.92,38.29 6.92,37.53 9.21,38.54 10.86,38.54 11.43,24.13 15.75,23.75 8.38,21.21 9.14,20.45 6.67,33.34 7.43,33.34 3.11,34.86 2.48,33.46 3.37,33.46 4.76,33.34 0.76,32.58 0.83,11.37 23.62,23.24 24.13,24.26 23.75,25.02 24.32,22.99 24.07,21.97 24.51,25.02 20.83,24.89 19.05,24.89 22.03,18.86 23.69,18.86 24.83,18.86 21.46,14.6 36.39,13.78 35.62,14.16 32.45,17.08 33.59,18.35 34.1,20.26 30.54,19.75 22.8,9.84 24.07,9.84 26.73,9.84
  pour Top (isolate 0.127, rank 6): -0.64,41.91 56.51,41.91 56.51,-0.63 -0.64,-0.63
  pour Bottom (isolate 0.127, rank 6): -0.64,41.91 56.51,41.91 56.51,-0.63 -0.64,-0.63
  pour Top (isolate 0.254, no thermals): 16.38,8.76 14.86,8.76 14.6,8.51 14.6,7.62 14.35,7.37 14.35,5.33 14.99,4.7 16.64,4.7 17.14,5.21 17.14,8.38 16.76,8.76
INT  (via drill 0.25 pad 0.51)
  Top 0.152: U5.13 16.16,30.83 v16.38,30.61 | U2.14 18.68,18.68 v18.8,18.8
  Bottom 0.152: v18.8,18.8 18.8,19.3 17.4,20.7 17.4,26.29 16.06,27.62 16.06,30.29 v16.38,30.61
IO8  (via drill 0.25 pad 0.51)
  Top 0.152: U2.11 18.16,16.89 17.91,16.64 17.91,15.56 v17.34,14.99
  Bottom 0.152: J4.3 21.84,7.49 20.19,9.14 18.29,9.14 15.62,11.81 15.62,14.1 16.51,14.99 v17.34,14.99
IO10  (via drill 0.25 pad 0.51)
  Top 0.152: U2.13 19.34,17.69 v19.56,17.91
  Bottom 0.152: J1.10 4.55,29.59 6.22,29.59 7.11,28.7 7.11,27.43 8.76,25.78 13.84,25.78 14.48,26.42 15.75,26.42 16.64,25.53 16.64,19.68 18.41,17.91 v19.56,17.91
IO19
  Top 0.152: U2.30 11.13,17.69 9.4,19.43 8,19.43 7.49,19.94 7.49,25.91 6.35,27.05 5.14,27.05 3.9,28.3 J1.11
IO20
  Top 0.152: U2.31 10.77,17.29 9.02,19.05 7.87,19.05 7.11,19.81 7.11,21.21 6.35,21.97 5.08,21.97 4.51,22.54 4.51,24.45 3.3,25.65 J1.12
IO21
  Top 0.152: U2.32 10.54,16.89 8.76,18.67 7.24,18.67 6.1,19.81 5.97,19.94 5.84,20.07 J1.5
IO22
  Top 0.152: J1.4 8.79,18.14 10.67,16.26 10.79,16.13 10.83,16.09 U2.34
IO23  (via drill 0.25 pad 0.51)
  Top 0.152: U2.35 10.59,15.69 9.4,16.89 v9.14,16.89 | J1.3 7.45,15.59 v7.56,15.49
  Bottom 0.152: v9.14,16.89 8.95,16.89 v7.56,15.49
IO24  (via drill 0.25 pad 0.51)
  Top 0.152: U2.36 10.94,15.29 10.87,15.37 10.08,15.37 v9.36,16.09 | J1.2 6.83,13.05 v8.13,14.35
  Bottom 0.152: v9.36,16.09 9.36,15.58 v8.13,14.35
IO25  (via drill 0.25 pad 0.51)
  Top 0.152: U2.37 10.91,14.89 10.74,15.06 9.7,15.06 8.54,16.22 v8.54,17.56
  Bottom 0.152: J1.14 4.3,19.67 4.36,19.62 4.42,19.56 7.05,19.56 8.54,18.06 v8.54,17.56
MISO  (via drill 0.25 pad 0.51)
  Top 0.152: U2.6 19.78,14.89 v20.51,15.62 | v25.4,15.88 26.29,16.76 26.29,23.24 v26.54,23.5 | U5.17 14.02,28.25 14.48,28.7 16.89,28.7 v17.02,28.83
  Bottom 0.152: J4.1 26.83,4.41 24.89,6.35 24.89,11.3 24.89,15.37 v25.4,15.88 24.89,16.38 22.99,16.38 22.61,16 20.89,16 v20.51,15.62 | v17.02,28.83 22.1,28.83 26.54,24.38 v26.54,23.5
MOSI  (via drill 0.25 pad 0.51)
  Top 0.152: U5.16 12.37,28.9 12.19,29.08 12.19,29.97 10.54,31.62 7.87,31.62 7.11,32.38 2.67,32.38 1.27,30.99 1.27,13.21 v1.78,12.7 | U2.5 19.41,14.49 v19.56,14.35
  Bottom 0.152: v19.56,14.35 19.18,13.97 16.76,13.97 16.38,13.59 16.38,12.06 18.54,9.91 20.7,9.91 25.53,5.08 25.53,3.02 J4.5 24.38,1.91 23.11,3.17 21.21,3.17 20.57,3.81 20.57,5.59 19.62,6.54 11.11,6.54 7.75,9.91 7.75,11.18 6.98,11.94 2.54,11.94 v1.78,12.7
N$2
  Top 0.152: D1.+ R2.1
N$3  (via drill 0.25 pad 0.51)
  Top 0.152: U2.29 11.24,18.09 9.52,19.81 8.25,19.81 7.87,20.19 7.87,27.43 v8.13,27.69 | R8.1 v5.84,33.53
  Bottom 0.152: v5.84,33.53 5.84,33.02 7.11,31.75 7.11,29.72 8.13,28.7 v8.13,27.69
N$5
  Top 0.254: SW1.COM1 46.79,38.48 45.08,38.48 40.64,34.04 R16.2
N$6
  Top 0.152: D4.+ 5.84,35.81 R8.2
N$7
  Top 0.152: R9.2 25.53,24.77 25.91,25.15 27.25,25.15 K3.1
N$8
  Top 0.203: R15.2 17.53,23.88 X2.3 18.16,23.75 19.3,22.61 20.45,22.61 C22.2
N$11
  Top 0.203: R12.2 D7.-
N$12  (via drill 0.25 pad 0.51)
  Top 0.508: U6.2 v34.42,15.88
  other vias: 34.92,15.88 34.92,15.37 30.35,9.91 31.11,9.91 29.84,10.16 29.84,10.8
  pour Top (isolate 0.254, no thermals): 33.02,16.13 34.92,16.13 35.18,15.88 35.31,15.75 35.31,14.99 34.8,14.99 34.29,15.49 34.16,15.62 33.02,15.62
  pour Top (isolate 0.254, no thermals): 30.73,13.46 32.13,13.46 32.13,9.4 28.07,9.4 27.3,10.16 27.3,12.57 27.43,12.7 28.19,12.7 28.32,12.57 28.32,11.68 28.83,11.18 30.23,11.18 30.73,11.68
  pour Bottom (isolate 0.254, no thermals): 29.72,10.03 29.72,14.1 31.75,16.13 35.05,16.13 35.31,15.88 35.31,14.86 35.05,14.6 32.77,14.6 31.5,13.34 31.5,10.03 31.24,9.78 29.97,9.78
N$13
  Bottom 0.508: J5.11 37.34,10.86 37.34,9.78 38.48,8.64 41.4,8.64 44.88,12.12 J8.1
N$14
  Top 0.254: U6.6 30.46,14.92 30.23,14.69 30.23,13.15 C25.2
N$15
  Top 0.152: D2.+ R3.1
N$16
  Top 0.305: U5.8 20.46,30.85 C19.2 25.15,29.08 X1.3
N$17
  Top 0.305: U5.9 20.82,31.5 21.46,30.86 C20.2 23.88,30.86 X1.1
N$20
  Top 0.254: U3.8 37.1,31.13 R10.1
N$26
  Top 0.254: U6.4 R18.1 C26.1 R19.2
PIN2
  Bottom 0.508: J6.11 37.4,15.94 37.66,15.68 39.69,15.68 39.94,15.43 J9.00 40.89,14.73 41.66,15.49 41.66,17.02 42.57,17.93 J8.2
PIN3  (via drill 0.25 pad 0.51)
  Top 0.508: v41.66,19.18 v41.66,7.81
  Bottom 0.508: J6.00 39.94,17.46 v41.66,19.18 43.38,19.18 J8.3 | J7.11 37.34,12.76 36.51,12.76 36.07,12.32 36.07,9.52 37.78,7.81 v41.66,7.81
PIN5
  Bottom 0.508: J9.11 36.58,14.73 36.07,15.24 36.07,17.27 38.86,20.07 42.16,20.07 43.18,21.08 43.18,24.77 44.58,26.16 J8.5
PIN7
  Bottom 0.508: J8.7 47.73,18.77 45.53,16.57 43.62,16.57 43.05,16 43.05,13.21 42.67,12.83 J7.00
QSPI_CSN  (via drill 0.25 pad 0.51)
  Top 0.152: R9.1 U4.1 25.53,16.76 24.38,15.62 v24.38,15.37 | v18.54,12.19 17.98,12.19 U2.56
  Bottom 0.152: v24.38,15.37 22.35,13.34 20.32,13.34 19.18,12.19 v18.54,12.19
QSPI_SCK  (via drill 0.25 pad 0.51)
  Top 0.152: U2.52 16.24,11.51 16.76,10.99 19.24,10.99 v19.3,11.05 | U4.6 v22.99,12.45
  Bottom 0.152: v19.3,11.05 20.57,12.32 22.86,12.32 v22.99,12.45
QSPI_SIO_0  (via drill 0.25 pad 0.51)
  Top 0.152: U2.53 16.64,11.55 16.89,11.3 18.54,11.3 v18.8,11.56 | U4.5 21.72,13.08 21.46,12.83 v21.15,12.83
  Bottom 0.152: v18.8,11.56 19.18,11.56 20.45,12.83 v21.15,12.83
QSPI_SIO_1  (via drill 0.25 pad 0.51)
  Top 0.152: U2.55 17.44,13.42 v17.4,13.46 | U4.2 24.26,16.26 v23.88,15.88
  Bottom 0.152: v17.4,13.46 19.43,13.46 20.07,14.1 21.72,14.1 22.73,15.11 22.73,15.49 23.11,15.88 v23.88,15.88
QSPI_SIO_2  (via drill 0.25 pad 0.51)
  Top 0.152: U4.3 22.99,15.75 v23.37,15.37 | v16.89,12.95 17.04,12.8 U2.54
  Bottom 0.152: v16.89,12.95 19.43,12.95 20.19,13.72 21.84,13.72 23.37,15.24 v23.37,15.37
QSPI_SIO_3  (via drill 0.25 pad 0.51)
  Top 0.152: U2.51 15.84,11.47 16.64,10.67 18.92,10.67 19.05,10.54 v20.07,10.54 | U4.7 v24.26,12.45
  Bottom 0.152: v20.07,10.54 20.07,11.18 20.83,11.94 23.75,11.94 v24.26,12.45
RST_N
  Top 0.152: U5.19 12.42,26.95 10.54,28.83 R11.1
RUN  (via drill 0.25 pad 0.51)
  Top 0.152: U2.26 13.44,19.45 12.83,20.07 12.83,24.51 14.16,25.84 14.16,26.99 v14.99,27.81 | v11.68,35.81 R14.1 10.92,36.7 12.06,37.85 12.06,38.29 K2.2
  Bottom 0.152: v14.99,27.81 14.99,32.51 v11.68,35.81
RX  (via drill 0.25 pad 0.51)
  Top 0.152: U2.3 19.81,13.69 20.19,14.08 20.19,14.6 21.08,15.49 21.08,17.65 v21.34,17.91 | J3.1 31.19,33.66 18.29,33.66 17.53,32.89 17.53,27.43 17.02,26.92 v15.75,26.92
  Bottom 0.152: v21.34,17.91 20.7,18.54 19.43,18.54 19.18,18.29 18.54,18.29 17.02,19.81 17.02,25.78 15.87,26.92 v15.75,26.92 15.62,26.8 8.25,26.8 7.49,27.56 7.49,28.83 5.84,30.48 J1.9
RX_CAN  (via drill 0.25 pad 0.51)
  Top 0.152: D2.- 35.94,3.87 35.94,4.45 35.69,4.7 v34.67,4.7 | U5.2 21.31,26.95 21.59,26.67 23.37,26.67 23.75,26.29 28.96,26.29 v29.21,26.54 29.21,26.8 29.73,27.32 U3.4
  Bottom 0.152: v34.67,4.7 32.25,4.7 28.83,8.12 28.83,26.16 v29.21,26.54
SCK  (via drill 0.25 pad 0.51)
  Top 0.152: U5.14 12.49,30.18 10.67,32 8.13,32 7.37,32.77 2.54,32.77 0.89,31.11 0.89,12.57 v1.52,11.94 | v19.68,5.46 19.94,5.72 23.08,5.72 J4.2 | U2.4 18.16,14.09 v17.78,14.48
  Bottom 0.152: J4.2 24.38,5.59 20.45,9.52 18.41,9.52 16,11.94 16,13.84 16.64,14.48 v17.78,14.48 | v19.68,5.46 18.99,6.16 10.98,6.16 7.37,9.78 7.37,11.05 6.79,11.62 1.84,11.62 v1.52,11.94
SCL  (via drill 0.25 pad 0.51)
  Top 0.152: U2.9 19.78,16.09 20.45,16.76 20.45,18.8 v20.19,19.05 | v14.22,24.51 15.24,24.51 16.13,25.4 21.34,25.4 21.59,25.15 22.35,25.15 v22.86,25.65 | v4.57,34.04 2.03,34.04 v1.65,33.66 | v14.99,36.32 14.73,36.32 R4.1
  Bottom 0.152: v14.22,24.51 13.97,24.51 13.84,24.64 7.87,24.64 6.45,23.21 J1.6 5.84,23.24 4.57,24.51 4.57,26.16 3.87,26.86 2.35,26.86 1.71,27.5 1.71,33.59 v1.65,33.66 | J2.1 22.05,36.32 v14.99,36.32 5.97,36.32 4.57,34.92 v4.57,34.04 | v22.86,25.65 22.48,25.27 22.48,20.32 21.21,19.05 v20.19,19.05
SDA  (via drill 0.25 pad 0.51)
  Top 0.152: U2.8 19.88,15.69 20.76,16.57 20.76,19.62 v20.83,19.68 | v14.73,25.02 14.99,25.02 15.68,25.72 22.03,25.72 v22.1,25.65 | J1.7 5.84,25.78 4.44,27.18 2.54,27.18 2.09,27.62 2.09,31.24 2.92,32.07 4.13,32.07 v4.44,31.75 | R1.1 v12.57,36.83
  Bottom 0.152: v14.73,25.02 6.58,25.02 J1.7 | J2.2 20.56,36.83 v12.57,36.83 5.71,36.83 4.06,35.18 4.06,32.13 v4.44,31.75 | v22.1,25.65 22.1,20.95 v20.83,19.68
SWDCLK  (via drill 0.25 pad 0.51)
  Top 0.152: U2.24 14.24,18.4 14.48,18.16 15.37,18.16 v15.49,18.03
  Bottom 0.152: v15.49,18.03 16.26,18.03 18.03,16.26 19.94,16.26 20.45,16.76 22.35,16.76 22.73,17.14 26.92,17.14 28.32,15.75 28.32,8.06 32.19,4.19 36.7,4.19 37.59,5.08 44.96,5.08 47.37,5.08 J12.3
SWDIO  (via drill 0.25 pad 0.51)
  Top 0.152: U2.25 13.84,18.16 v14.35,17.65
  Bottom 0.152: v14.35,17.65 14.48,17.53 16.26,17.53 17.91,15.88 20.07,15.88 20.57,16.38 22.48,16.38 22.86,16.76 26.8,16.76 27.94,15.62 27.94,7.94 32.07,3.81 36.83,3.81 37.72,4.7 44.7,4.7 45.21,4.7 J12.2
TX  (via drill 0.25 pad 0.51)
  Top 0.152: U2.2 19.94,13.29 20.7,14.06 20.7,14.54 21.53,15.37 21.53,17.21 v21.59,17.27 | v34.42,35.94 31.75,33.27 18.54,33.27 17.91,32.64 17.91,26.67 17.4,26.16 14.99,26.16 v14.73,25.91
  Bottom 0.152: J1.8 5.84,28.07 8.51,25.4 14.22,25.4 v14.73,25.91 15.75,25.91 16.26,25.4 16.26,19.56 18.54,17.27 v21.59,17.27 | v34.42,35.94 34.42,38.08 J3.2
TX_CAN  (via drill 0.25 pad 0.51)
  Top 0.152: 30.21,31.13 U3.1 31.23,31.13 31.5,30.86 31.5,27.05 30.35,25.91 v29.72,25.91 23.62,25.91 23.23,26.3 U5.1 | D1.- 36,1.97 36.83,2.79 36.83,4.32 v36.45,4.7
  Bottom 0.152: v29.72,25.91 29.21,25.4 29.21,8.26 32.26,5.21 35.94,5.21 v36.45,4.7
USB5V
  Top 0.813: D6.1 40.51,19.68 40.51,7.87 39.12,6.48 18.92,6.48 18.03,5.59 18.03,1.5 17.29,0.76 8.89,0.76 8.14,1.52 8.14,6.39 F1.1
USB+
  Top 0.152: J10.3 13.17,6.45 13.02,6.6 13.02,6.86 13.97,7.81 13.97,10.8 14.16,10.99 14.22,11.05 14.24,11.06 U2.47
USB-
  Top 0.152: J10.2 12.52,6.42 12.71,6.62 12.71,6.98 13.59,7.86 13.59,10.92 13.84,11.18 U2.46
VIN
  pour Top (isolate 0.254, no thermals): 48.89,11.43 47.48,12.84 45.72,14.58 45.72,18.77 42.4,22.61 39.24,22.61 39.24,25.37 42.19,28.45 46.99,28.45 48.64,26.8 48.64,25.65 50.42,23.88 50.42,16.76 52.96,14.22 52.96,11.43 52.32,10.8 49.53,10.8
VIN_12V
  pour Top (isolate 0.254, rank 2, no thermals): 35.05,24.38 36.96,24.38 36.96,18.67 37.21,17.78 37.34,17.65 39.24,17.65 39.37,17.53 39.37,16.26 39.24,16.13 35.94,16.13 35.56,16.51 33.66,16.51 33.66,17.27 34.92,18.41 34.92,24.26
XIN
  Top 0.203: U2.20 15.84,19.65 16.64,20.45 19.3,20.45 X2.1 20.7,21.84 21.21,21.84 C21.2
XOUT
  Top 0.203: U2.21 15.44,19.89 16.13,20.57 16.13,20.95 R15.1

### Text on the board
tPlace: 120Ω | RST | 120Ω | I2C | UART | LED | GND | 3V | SDA | SCL | GND | 3V | TX | RX | CANL | CANH | GND | VIN | 10 | RX | 19 | TX | 20 | SDA | A3 | SCL | 25 | 21 | BOOT | 22 | A0 | 23 | A1 | 24 | A2 | GND | 3V3 | Iout=1A | IO8 | SCK | SO | VIN(9-28V) | PWR | GND | SI | 3V | RX | 3V | SWD | SWC | GND | TX
bPlace: CANL | V1.1 | RP2040 | CANH | GND | longan-labs.cc | VIN | OBD-II | CAN OPEN